# Altium schematic sheet Affichage-LCD.SchDoc: Affichage LCD
size Letter; ApprovedBy: kc; Organization: Cegep Limoilou; Address1: 1300, 8e Avenue; Address2: Québec, QC; Address3: Canada; Address4: G1J 5L5; SheetNumber: 7; SheetTotal: 10
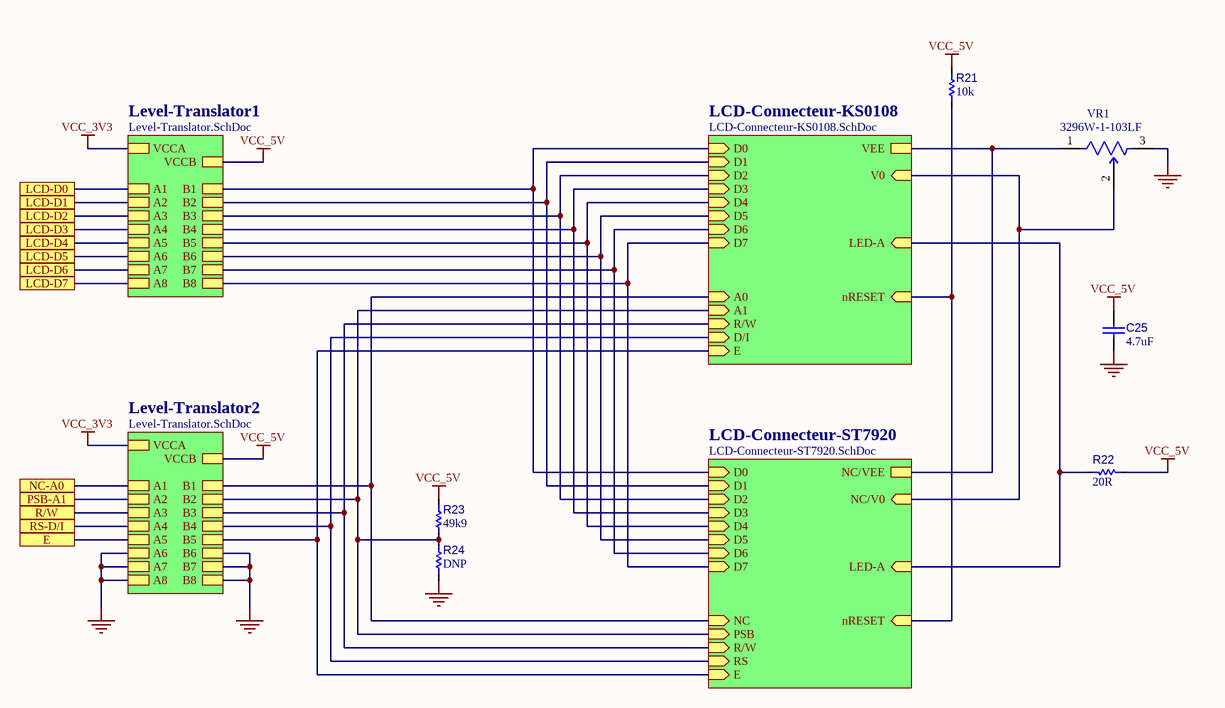
[diagram p0: Affichage-LCD.SchDoc]

## Parts
C25  value 4.7uF  [C_2012[0805]]  (hidden comment: Cap 4.7uF 0805)
R21  value 10k  [R_1005[0402]]  (hidden comment: Res 10k 1% 0402)
R22  value 20R  [R_3216[1206]]  (hidden comment: Res 20R 1206)
R23  value 49k9  [R_1005[0402]]  (hidden comment: Res 49k9 1% 0402)
R24  value DNP  [R_1005[0402]]  (hidden comment: Res 49k9 1% 0402)  (no BOM)
VR1  3296W-1-103LF  [R-POT-TH-TOP]

## Sub-sheets
LCD-Connecteur-KS0108 = LCD-Connecteur-KS0108.SchDoc: D0 (in), D1 (in), D2 (in), D3 (in), D4 (in), D5 (in), D6 (in), D7 (in), A0 (in), LED-A (in), A1 (in), V0 (in), E (in), nRESET (in), VEE, R/W (in), D/I (in)
LCD-Connecteur-ST7920 = LCD-Connecteur-ST7920.SchDoc: NC/V0 (in), RS (in), R/W (in), E (in), D0 (in), D1 (in), D2 (in), D3 (in), D4 (in), D5 (in), D6 (in), D7 (in), NC (in), PSB (in), LED-A (in), nRESET (in), NC/VEE
Level-Translator1 = Level-Translator.SchDoc: A1, B1, A2, A3, A4, A5, A6, A7, A8, B2, B3, B4, B5, B6, B7, B8, VCCA, VCCB
Level-Translator2 = Level-Translator.SchDoc: A1, B1, A2, A3, A4, A5, A6, A7, A8, B2, B3, B4, B5, B6, B7, B8, VCCA, VCCB

## Ports
E (see PCB-Support-STM32F407[3D]), LCD-D0 (see PCB-Support-STM32F407[3D]), LCD-D1 (see PCB-Support-STM32F407[3D]), LCD-D2 (see PCB-Support-STM32F407[3D]), LCD-D3 (see PCB-Support-STM32F407[3D]), LCD-D4 (see PCB-Support-STM32F407[3D]), LCD-D5 (see PCB-Support-STM32F407[3D]), LCD-D6 (see PCB-Support-STM32F407[3D]), LCD-D7 (see PCB-Support-STM32F407[3D]), NC-A0 (see PCB-Support-STM32F407[3D]), PSB-A1 (see PCB-Support-STM32F407[3D]), R/W (see PCB-Support-STM32F407[3D]), RS-D/I (see PCB-Support-STM32F407[3D])

## Nets
GND: C25.1 R24.1 VR1.3(CW) ; sheet Level-Translator2/A6, sheet Level-Translator2/A7, sheet Level-Translator2/A8, sheet Level-Translator2/B6, sheet Level-Translator2/B7, sheet Level-Translator2/B8
VCC_3V3: sheet Level-Translator1/VCCA, sheet Level-Translator2/VCCA
VCC_5V: C25.2 R21.2 R22.1 R23.2 ; sheet Level-Translator1/VCCB, sheet Level-Translator2/VCCB
E: port E, sheet Level-Translator2/A5
LCD-D0: port LCD-D0, sheet Level-Translator1/A1
LCD-D1: port LCD-D1, sheet Level-Translator1/A2
LCD-D2: port LCD-D2, sheet Level-Translator1/A3
LCD-D3: port LCD-D3, sheet Level-Translator1/A4
LCD-D4: port LCD-D4, sheet Level-Translator1/A5
LCD-D5: port LCD-D5, sheet Level-Translator1/A6
LCD-D6: port LCD-D6, sheet Level-Translator1/A7
LCD-D7: port LCD-D7, sheet Level-Translator1/A8
NC-A0: port NC-A0, sheet Level-Translator2/A1
PSB-A1: port PSB-A1, sheet Level-Translator2/A2
R/W: port R/W, sheet Level-Translator2/A3
RS-D/I: port RS-D/I, sheet Level-Translator2/A4
NetR21_1: R21.1 ; sheet LCD-Connecteur-KS0108/nRESET, sheet LCD-Connecteur-ST7920/nRESET
NetR22_2: R22.2 ; sheet LCD-Connecteur-KS0108/LED-A, sheet LCD-Connecteur-ST7920/LED-A
NetR23_1: R23.1 R24.2 ; sheet LCD-Connecteur-KS0108/A1, sheet LCD-Connecteur-ST7920/PSB, sheet Level-Translator2/B2
NetVR1_1: VR1.1(CCW) ; sheet LCD-Connecteur-KS0108/VEE, sheet LCD-Connecteur-ST7920/NC/VEE
NetVR1_2: VR1.2(WIPER) ; sheet LCD-Connecteur-KS0108/V0, sheet LCD-Connecteur-ST7920/NC/V0
(unnamed): sheet LCD-Connecteur-KS0108/D0, sheet LCD-Connecteur-ST7920/D0, sheet Level-Translator1/B1
(unnamed): sheet LCD-Connecteur-KS0108/D1, sheet LCD-Connecteur-ST7920/D1, sheet Level-Translator1/B2
(unnamed): sheet LCD-Connecteur-KS0108/D2, sheet LCD-Connecteur-ST7920/D2, sheet Level-Translator1/B3
(unnamed): sheet LCD-Connecteur-KS0108/D3, sheet LCD-Connecteur-ST7920/D3, sheet Level-Translator1/B4
(unnamed): sheet LCD-Connecteur-KS0108/D4, sheet LCD-Connecteur-ST7920/D4, sheet Level-Translator1/B5
(unnamed): sheet LCD-Connecteur-KS0108/D5, sheet LCD-Connecteur-ST7920/D5, sheet Level-Translator1/B6
(unnamed): sheet LCD-Connecteur-KS0108/D6, sheet LCD-Connecteur-ST7920/D6, sheet Level-Translator1/B7
(unnamed): sheet LCD-Connecteur-KS0108/D7, sheet LCD-Connecteur-ST7920/D7, sheet Level-Translator1/B8
(unnamed): sheet LCD-Connecteur-KS0108/A0, sheet LCD-Connecteur-ST7920/NC, sheet Level-Translator2/B1
(unnamed): sheet LCD-Connecteur-KS0108/E, sheet LCD-Connecteur-ST7920/E, sheet Level-Translator2/B5
(unnamed): sheet LCD-Connecteur-KS0108/R/W, sheet LCD-Connecteur-ST7920/R/W, sheet Level-Translator2/B3
(unnamed): sheet LCD-Connecteur-KS0108/D/I, sheet LCD-Connecteur-ST7920/RS, sheet Level-Translator2/B4

## Notes on the sheet
- Titre :
- Conception :
- Date :
- Approbation :
- Heure :
- Révision :
- Feuille
- de
- Fichier :

## Library data of the parts
C25 = CAP003: Capacitor type 1; Manufacturer 1: Taiyo Yuden; Manufacturer Part Number 1: TMK212AB7475KG-T; LibRef: CAP003; CEGEP: KCOND02SM; Tolerance: 10%; Rated Voltage: 25V; Dielectric: X7R; Supplier 1: LCSC; Supplier Part Number 1: C163186; Mounting Technology: SMT
R21 = RES003: Resistor type 1; Manufacturer 1: Vishay; Manufacturer Part Number 1: CR0402F1002T1LF; LibRef: RES003; Puissance: 1/16W; Max Working Voltage: 50V; Tolerance: 1%; Mounting Technology: SMT; Supplier 1: Digikey; Supplier Part Number 1: 541-10.0KLCT-ND
R22 = RES020: Resistor type 1; Manufacturer 1: Yageo; Manufacturer Part Number 1: RC1206FR-0720RL; LibRef: RES020; CEGEP: RESI00020SMT; Tolerance: 1%; Puissance: 1/4W; Max Working Voltage: 200V; Mounting Technology: SMT; Supplier 1: LCSC; Supplier Part Number 1: C114941
R23 R24 = RES026: Resistor type 1; Manufacturer 1: Yageo; Manufacturer Part Number 1: RC0402FR-0749k9L; LibRef: RES026; Puissance: 1/16W; Max Working Voltage: 50V; Tolerance: 1%; Mounting Technology: SMT; Supplier 1: LCSC; Supplier Part Number 1: C137969
VR1 = RP-POT10K-MULTI-TURN-TOP-TH: TRIMMER 10K OHM 0.5W PC PIN TOP; Manufacturer 1: JIERR; Manufacturer Part Number 1: 3296W-1-103LF; Mounting Technology: TH; Manufacturer 2: BOURNS; Manufacturer Part Number 2: 3296W-1-103LF; Supplier 1: LCSC; Supplier 2: LCSC; Supplier Part Number 1: C49190453; Supplier Part Number 2: C34846